# Altium schematic sheet DIB_555.SchDoc
size A
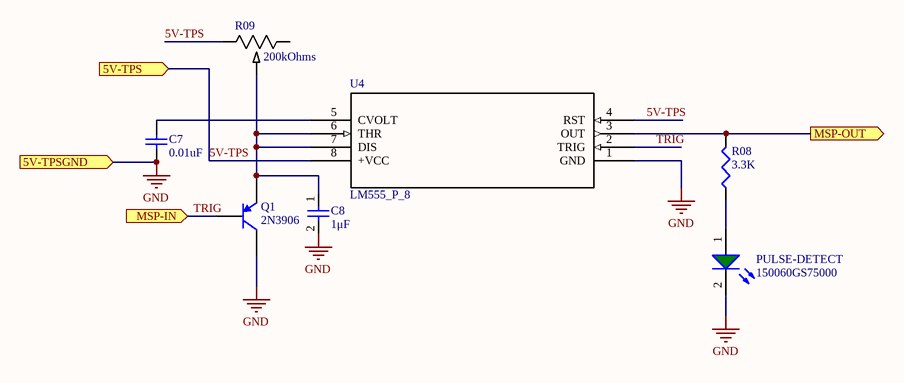
[diagram p0: DIB_555.SchDoc]

## Parts
C7  0.01uF  [1608[0603]]
C8  1μF  [WCAP-CSGP 0805, H=1.25mm]
PULSE-DETECT  150060GS75000  [LED_0603_Green]
Q1  2N3906  [TO-92A]
R08  3.3K  [J1-0603]
R09  200kOhms  [POT_3006P]
U4  LM555_P_8  [M08A-M]

## Ports
5V-TPS (in), 5V-TPSGND (in), MSP-IN (in), MSP-OUT (out)

## Nets
GND: C7.1 C8.2 PULSE-DETECT.2(C) Q1.3(C) U4.1(GND) ; port 5V-TPSGND
5V-TPS: R09.3 U4.4(RST) U4.8(+VCC) ; port 5V-TPS
MSP-OUT: R08.2 U4.3(OUT) ; port MSP-OUT
TRIG: Q1.2(B) U4.2(TRIG) ; port MSP-IN
NetC7_2: C7.2 U4.5(CVOLT)
NetC8_1: C8.1 Q1.1(E) R09.2 U4.6(THR) U4.7(DIS)
NetPULSE-DETECT_1: PULSE-DETECT.1(A) R08.1

Not connected (* = marked no-connect by the designer): R09 1

## Library data of the parts
C7 = Cap Semi: Capacitor (Semiconductor SIM Model); Published: 8-Jun-2000; LatestRevisionDate: 29-May-2009; LatestRevisionNote: IPC-7351 Footprint Added.; PackageReference: C1206; Publisher: Altium Limited; PackageDescription: Chip Capacitor; Value: 0.01uF
C8 = WCAP-CSGP 0805, 885012207026: CAP CER 1UF 50V 10% X5R 0805; Manufacturer: TDK; partNo: CGA4J3X5R1H105K125AB; ComponentLink1Description: TDK; ComponentLink1URL: http://www.TDK.com; Created by: Saurabh; Created Date: 3/9/2015; Capacitance: 1μF
PULSE-DETECT = WL-SMCW 0603  150060GS75000: SMD mono-color Chip LED, WL-SMCW, Green; Manufacturer: W黵th Elektronik eiSos GmbH; PartNo: 150060GS75000; ComponentLink1Description: Manufacturer; ComponentLink1URL: http://www.we-online.de; Created by: Christin Otto; Created Date: June 2013; ComponentLink2Description: Datasheet; ComponentLink2URL: http://katalog.we-online.com/led/datasheet/150060GS75000.pdf; Color: Green
Q1 = 2N3906: PNP General Purpose Amplifier; Published: 8-Jun-2000; LatestRevisionDate: 15-Jan-2003; LatestRevisionNote: PCB Footprint 'BCY-W3/D4.7' replaced; DatasheetVersion: 1997; PackageVersion: Sep-1998; PackageReference: TO-92A; Publisher: Altium Limited; PackageDescription: TO, Flat Index; 3 In-Line, Axial Leads; Body Dia. 4.5mm; Leads 0.51 x 0.48 mm (max); ComponentLink1Description: Manufacturer Link; ComponentLink1URL: http://www.fairchildsemi.com/; ComponentLink2Description: Datasheet; ComponentLink2URL: http://www.fairchildsemi.com/ds/2N%2F2N3906.pdf
R08 = Res3: Resistor; Published: 8-Jun-2000; LatestRevisionDate: 29-May-2009; LatestRevisionNote: IPC-7351 Footprint Added.; PackageReference: J1-0603; Publisher: Altium Limited; PackageDescription: Chip Resistor; Value: 3.3K
R09 = 3006P-1-204LF: Imported; Vendor: Bourns Electronics; HEADER_SECTION: Passives; HEADER_GROUP: Resistors; R-S_Number: 5219108; Tolerance: 10%; Voltage: Unknown; C: Copyright (C) 2015 Accelerated Designs. All rights reserved; Manufacturer_Part_Number: 3006P-1-204LF; Manufacturer_Name: Bourns Electronics; Mounting: Through Hole; Value: 200kOhms; Package/Case: Unknown; Current_Rating: Unknown; Copyright: Copyright (C) 2015 Accelerated Designs. All rights reserved
U4 = LM555_P_8: Imported; Manufacturer_Part_Number: lm555cnnopb; Vendor: National; RefDes: RefDes; Type: DEV; Value: Value